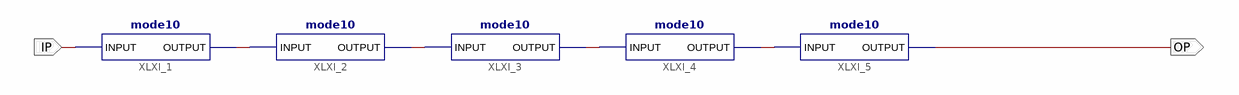
[diagram p0: schematic sheet 1]
// Xilinx ISE schematic div100k.sch (spartan6) as structural Verilog: 5 symbols, 2 ports
module div100k (
  input  IP,
  output OP
);

  wire XLXN_1, XLXN_2, XLXN_3, XLXN_4;

  mode10 XLXI_1 (.INPUT(IP), .OUTPUT(XLXN_1));
  mode10 XLXI_2 (.INPUT(XLXN_1), .OUTPUT(XLXN_2));
  mode10 XLXI_3 (.INPUT(XLXN_2), .OUTPUT(XLXN_3));
  mode10 XLXI_4 (.INPUT(XLXN_3), .OUTPUT(XLXN_4));
  mode10 XLXI_5 (.INPUT(XLXN_4), .OUTPUT(OP));
endmodule
